# Altium schematic sheet [01]-Title Page.SchDoc: ENTER SHEET TITLE
size B; Engineer: ENTER ENGINEER NAME; Organization: CUAir; Address1: L3, 12a Rodborough Rd; Address2: Frenchs Forest; Address3: NSW; Address4: Australia 2086; Revision: ENTER REVISION NUMBER; CompetitionYear: 2019; CPN: ENTER CPN; PROJECT: ENTER PROJECT NAME
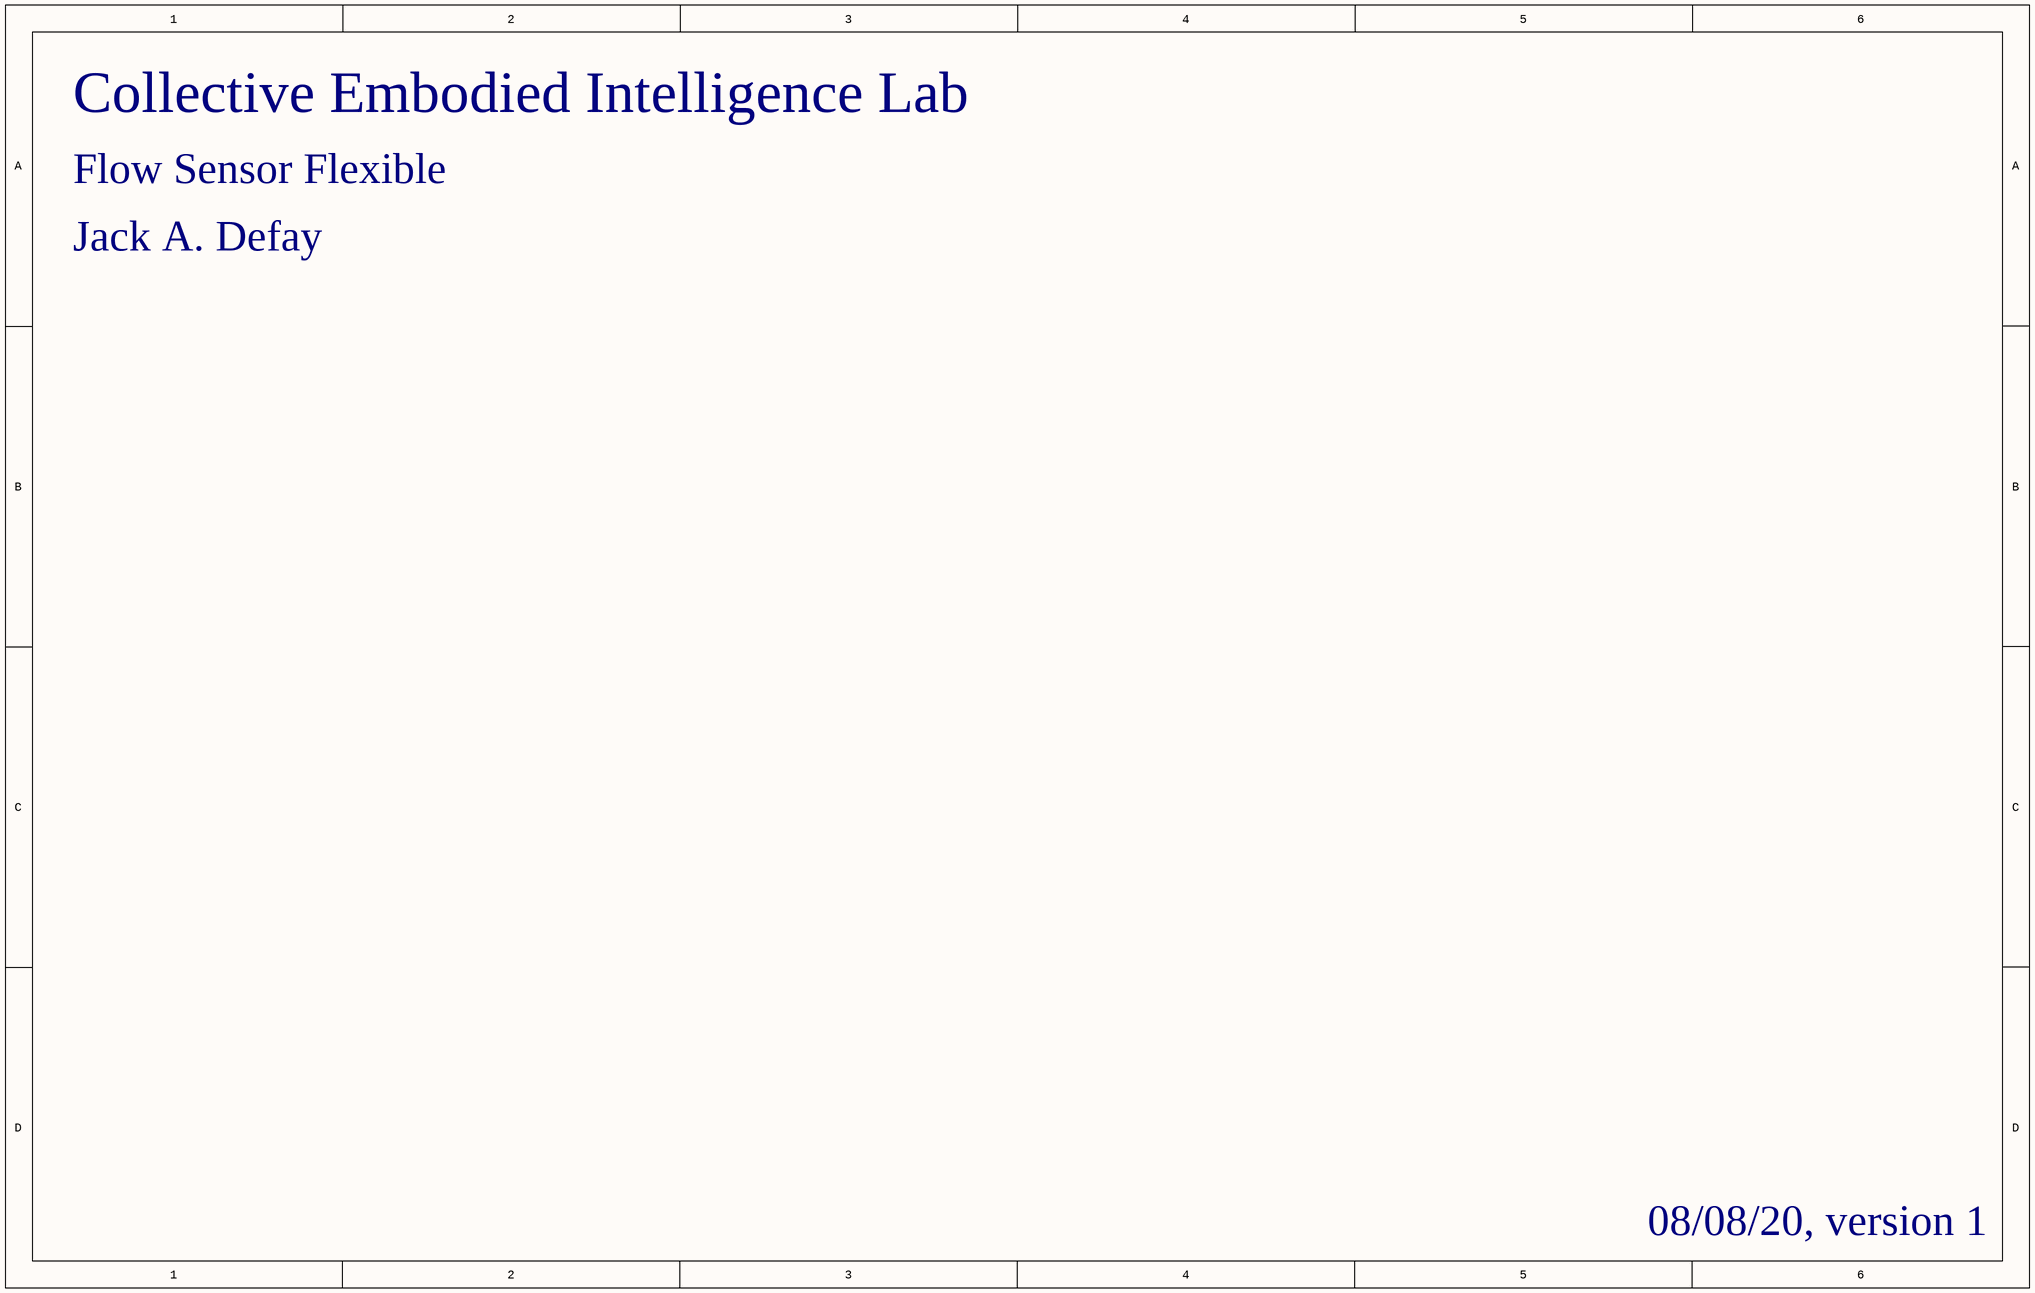
[diagram p0: [01]-Title Page.SchDoc]

## Notes on the sheet
- Collective Embodied Intelligence Lab
- Flow Sensor Flexible
- Jack A. Defay
- 08/08/20, version 1
- Cornell University Unmanned Air Systems
- PROJECT:
- ID:
- ENGINEER
- REVISION
- Project
- Title
- Size:
- Date:
- B
- Number:
- Revision:
- File: